# EAGLE design Summation line and synth (EAGLE 9.6.2)
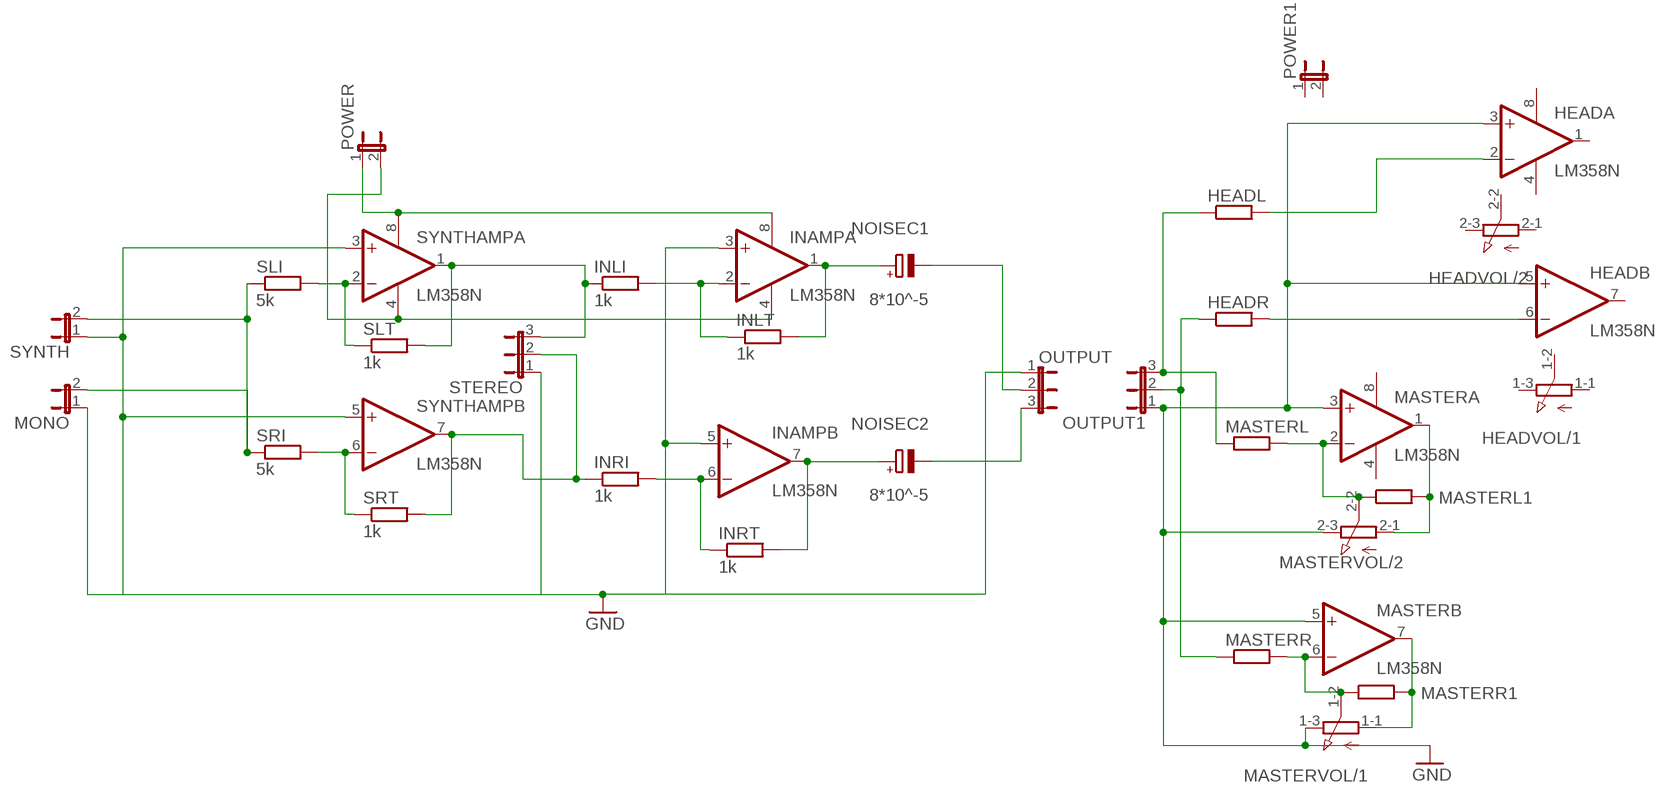
[diagram p0: schematic, sheet 1]

## Parts
HEAD  LM358N  [DIL08]
HEADL  R-EU_0207/7  [0207/7]
HEADR  R-EU_0207/7  [0207/7]
HEADVOL  3RP/1610G  [3RP/1610G]
INAMP  LM358N  [DIL08]
INLI  1k  R-EU_0207/7  [0207/7]
INLT  1k  R-EU_0207/7  [0207/7]
INRI  1k  R-EU_0207/7  [0207/7]
INRT  1k  R-EU_0207/7  [0207/7]
MASTER  LM358N  [DIL08]
MASTERL  R-EU_0207/7  [0207/7]
MASTERL1  R-EU_0207/7  [0207/7]
MASTERR  R-EU_0207/7  [0207/7]
MASTERR1  R-EU_0207/7  [0207/7]
MASTERVOL  3RP/1610G  [3RP/1610G]
MONO  JP1E  [JP1]
NOISEC1  8*10^-5  CPOL-EUE5-5  [E5-5]
NOISEC2  8*10^-5  CPOL-EUE5-5  [E5-5]
OUTPUT  JP2E  [JP2]
OUTPUT1  JP2E  [JP2]
POWER  JP1E  [JP1]
POWER1  JP1E  [JP1]
SLI  5k  R-EU_0207/7  [0207/7]
SLT  1k  R-EU_0207/7  [0207/7]
SRI  5k  R-EU_0207/7  [0207/7]
SRT  1k  R-EU_0207/7  [0207/7]
STEREO  JP2E  [JP2]
SYNTH  JP1E  [JP1]
SYNTHAMP  LM358N  [DIL08]

## Nets
GND: HEAD.3(A:+IN) HEAD.5(B:+IN) INAMP.3(A:+IN) INAMP.5(B:+IN) MASTER.3(A:+IN) MASTER.5(B:+IN) MASTERVOL.1-3(/1:E) MASTERVOL.2-3(/2:E) MONO.1 OUTPUT1.1 OUTPUT.1 STEREO.1 SYNTH.1 SYNTHAMP.3(A:+IN) SYNTHAMP.5(B:+IN)
N$1: INAMP.4(P:V-) POWER.2 SYNTHAMP.4(P:V-)
N$2: SLI.2 SLT.1 SYNTHAMP.2(A:-IN)
N$3: INAMP.6(B:-IN) INRI.2 INRT.1
N$4: SRI.2 SRT.1 SYNTHAMP.6(B:-IN)
N$5: INRI.1 SRT.2 STEREO.2 SYNTHAMP.7(B:OUT)
N$6: INAMP.2(A:-IN) INLI.2 INLT.1
N$7: INAMP.8(P:V+) POWER.1 SYNTHAMP.8(P:V+)
N$8: INLI.1 SLT.2 STEREO.3 SYNTHAMP.1(A:OUT)
N$9: INAMP.7(B:OUT) INRT.2 NOISEC2.+
N$10: INAMP.1(A:OUT) INLT.2 NOISEC1.+
N$11: NOISEC1.- OUTPUT.2
N$12: NOISEC2.- OUTPUT.3
N$13: MASTER.2(A:-IN) MASTERL1.1 MASTERL.2 MASTERVOL.2-2(/2:S)
N$14: HEADL.1 MASTERL.1 OUTPUT1.3
N$15: HEAD.2(A:-IN) HEADL.2
N$16: HEAD.6(B:-IN) HEADR.2
N$17: HEADR.1 MASTERR.1 OUTPUT1.2
N$18: MASTER.6(B:-IN) MASTERR1.1 MASTERR.2 MASTERVOL.1-2(/1:S)
N$21: MASTER.7(B:OUT) MASTERR1.2 MASTERVOL.1-1(/1:A)
N$22: MASTER.1(A:OUT) MASTERL1.2 MASTERVOL.2-1(/2:A)
SYNTHIN: MONO.2 SLI.1 SRI.1 SYNTH.2
Unconnected: HEAD.1(A:OUT) HEAD.7(B:OUT) HEADVOL.1-1(/1:A) HEADVOL.1-2(/1:S) HEADVOL.1-3(/1:E) HEADVOL.2-1(/2:A) HEADVOL.2-2(/2:S) HEADVOL.2-3(/2:E) POWER1.1 POWER1.2

## Power pins joined to a net without a drawn wire
V+: HEAD.8(P:V+) MASTER.8(P:V+)
V-: HEAD.4(P:V-) MASTER.4(P:V-)

## Library data of the parts
HEAD INAMP MASTER SYNTHAMP = linear:LM358: OP AMP also LM158; LM258; LM2904 Source: http://cache.national.com/ds/LM/LM158.pdf
HEADL HEADR INLI INLT INRI INRT MASTERL MASTERL1 MASTERR MASTERR1 SLI SLT SRI SRT = rcl:R-EU_: RESISTOR, European symbol; SPICEPREFIX: R
HEADVOL MASTERVOL = pot:3RP/1610G: 16mm Potentiometer two level Source: http://www.alphapotentiometers.net/html/16mm_pot_2.html
MONO POWER POWER1 SYNTH = jumper:JP1E: JUMPER
NOISEC1 NOISEC2 = rcl:CPOL-EU: POLARIZED CAPACITOR, European symbol; SPICEPREFIX: C
OUTPUT OUTPUT1 STEREO = jumper:JP2E: JUMPER

## Board
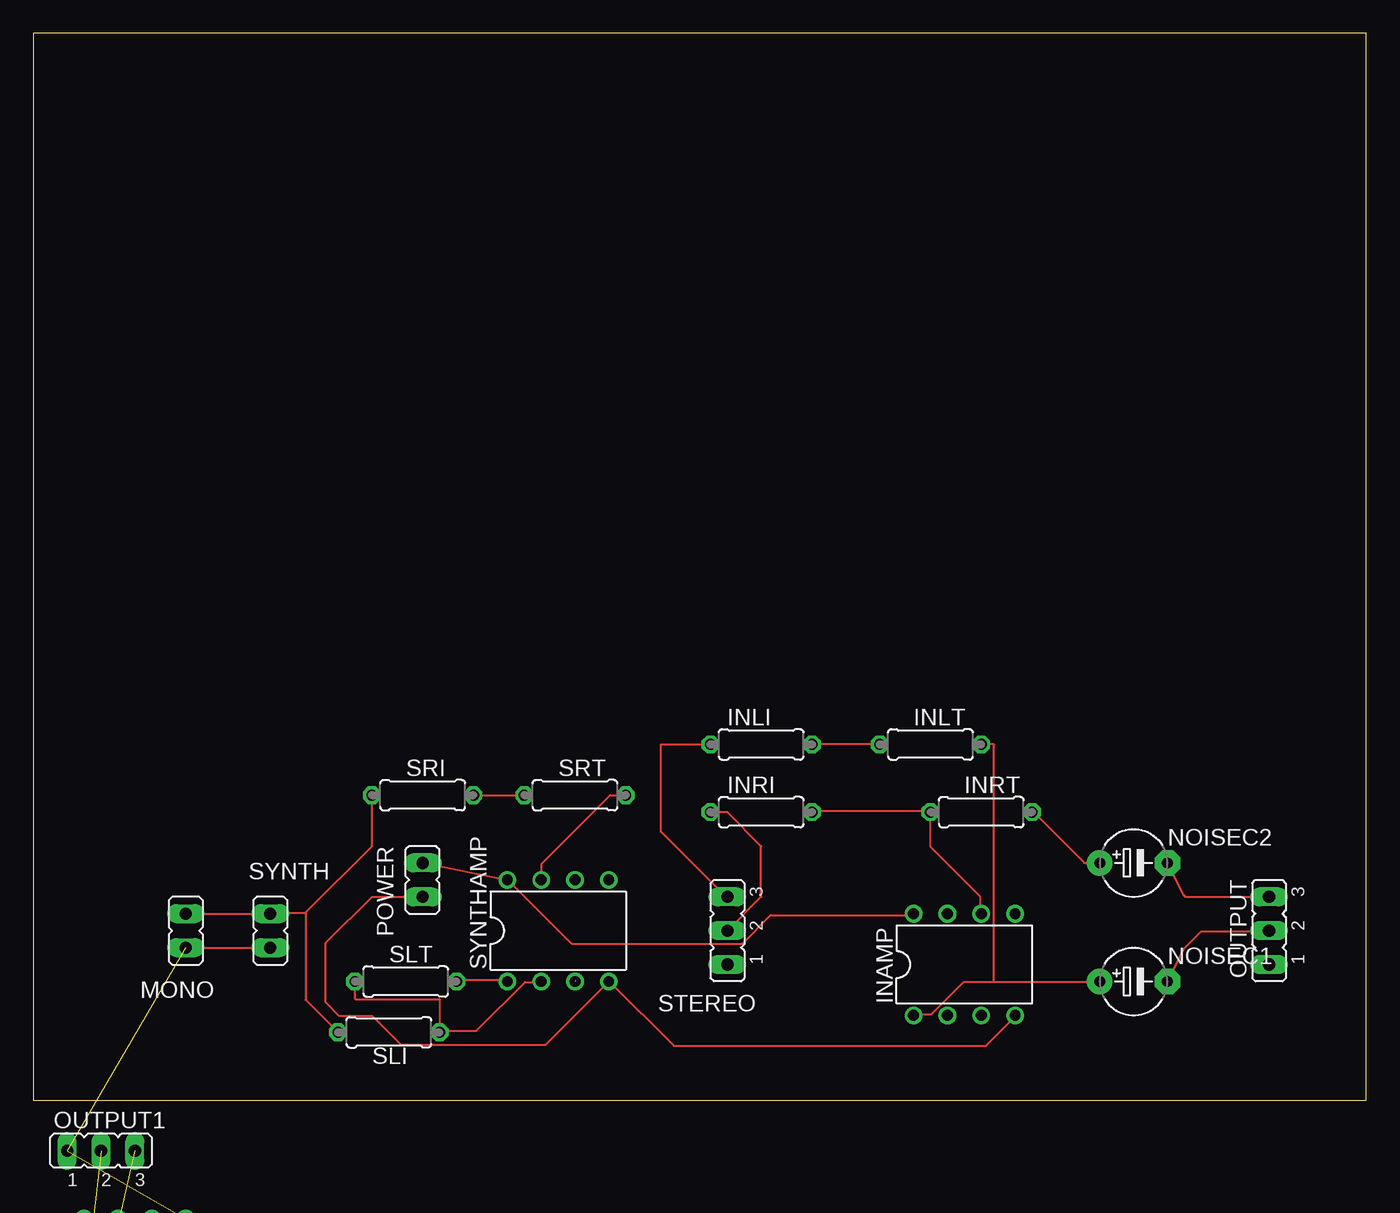
[diagram p1: board, top side]
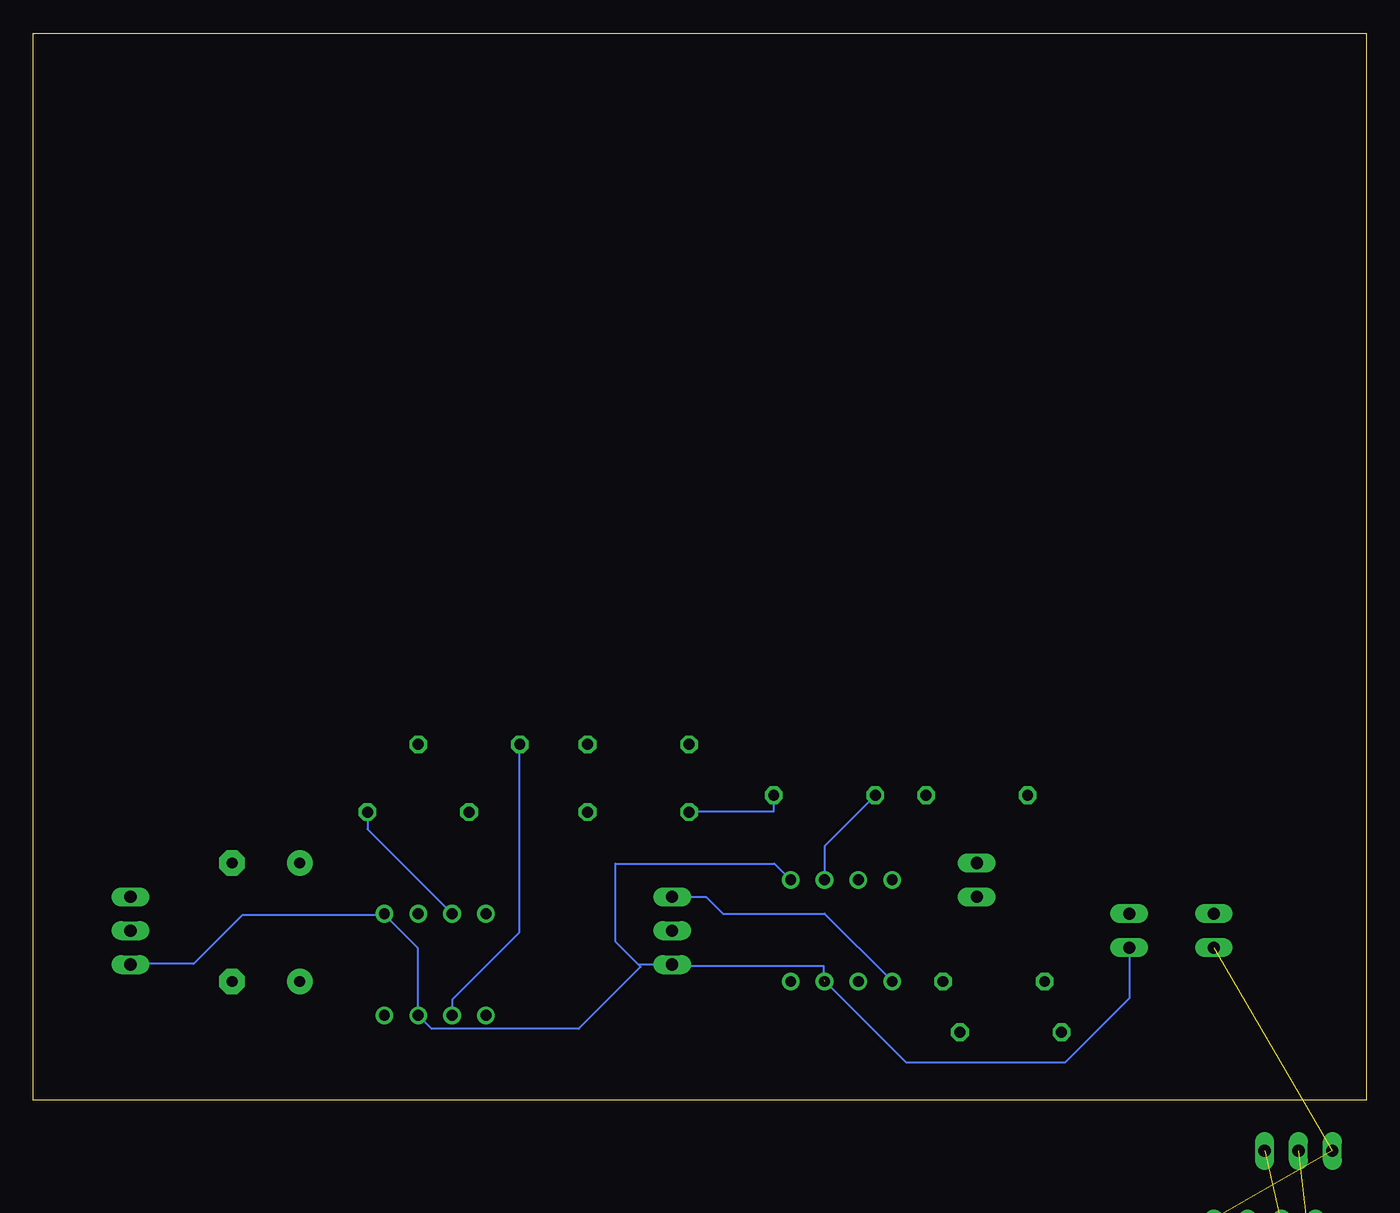
[diagram p2: board, bottom side, seen from below]

Size 100 x 80 mm. Coordinates in mm from the lower left corner, seen from the top.
Outline: 0,0 100,0 100,80 0,80 0,0
Copper layers (1*16): Top 0.035mm / dielectric 1.5mm / Bottom 0.035mm
Design rules "default": minimum track width 6mil, minimum drill 0.35mm, track to track 6mil, track to pad 6mil, pad to pad 6mil, via to via 6mil, smd to smd 6mil, copper to edge 40mil, drill to drill 6mil, minimum pad ring 10mil, minimum via ring 8mil, stop-mask expansion 4mil, vias tented up to drill 0mil, thermal gap 10mil

### Footprints (pad centres in the part's own frame; a part is rotated, then mirrored left to right if it is on the bottom)
DIL08 = drill 0.813 pad 1.27: 1 -3.81,-3.81; 2 -1.27,-3.81; 3 1.27,-3.81; 4 3.81,-3.81; 5 3.81,3.81; 6 1.27,3.81; 7 -1.27,3.81; 8 -3.81,3.81
0207/7 = drill 0.813 octagon: 1 -3.81,0; 2 3.81,0
3RP/1610G = drill 1.2 pad 2.184: 1-1 -5,0; 1-2 0,0; 1-3 5,0; 2-1 -5,5; 2-2 0,5; 2-3 5,5
JP1 = drill 0.914 long: 1 0,-1.27; 2 0,1.27
E5-5 = drill 0.813 pad 1.905: + -2.54,0 | drill 0.813 pad 1.905 octagon: - 2.54,0
JP2 = drill 0.914 long: 1 -2.54,0; 2 0,0; 3 2.54,0

### Placement (x,y rotation side)
HEAD  7.62,-12.7 0 top  (outside the outline)
HEADL  5.08,-31.75 0 top  (outside the outline)
HEADR  5.08,-36.83 0 top  (outside the outline)
HEADVOL  -8.89,-43.18 0 top  (outside the outline)
INAMP  69.85,10.16 0 top
INLI  54.61,26.67 0 top
INLT  67.31,26.67 0 top
INRI  54.61,21.59 0 top
INRT  71.12,21.59 0 top
MASTER  7.62,-22.86 0 top  (outside the outline)
MASTERL  5.08,-41.91 0 top  (outside the outline)
MASTERL1  -30.48,-60.96 0 top  (outside the outline)
MASTERR  5.08,-46.99 0 top  (outside the outline)
MASTERR1  -30.48,-66.04 0 top  (outside the outline)
MASTERVOL  -26.67,-43.18 0 top  (outside the outline)
MONO  11.43,12.7 0 top
NOISEC1  82.55,8.89 0 top
NOISEC2  82.55,17.78 0 top
OUTPUT  92.71,12.7 90 top
OUTPUT1  5.08,-3.81 0 top  (outside the outline)
POWER  29.21,16.51 180 top
POWER1  3.81,-54.61 0 top  (outside the outline)
SLI  26.67,5.08 0 top
SLT  27.94,8.89 0 top
SRI  29.21,22.86 0 top
SRT  40.64,22.86 0 top
STEREO  52.07,12.7 90 top
SYNTH  17.78,12.7 0 top
SYNTHAMP  39.37,12.7 0 top

### Tracks (layer width: path | path; a pad name or v marks a point on that pad's centre or on a via)
GND  (via drill 0.35)  (8 unrouted)
  Top 0.152: v51.97,10.06 STEREO.1 | MONO.1 SYNTH.1
  Bottom 0.152: OUTPUT.1 92.66,10.21 87.99,10.21 84.33,13.87 73.76,13.87 INAMP.5 73.61,13.87 71.17,11.43 71.17,6.4 INAMP.3 70.1,5.33 59.08,5.33 54.43,9.98 54.61,10.16 | v40.69,8.99 40.69,10.06 v51.97,10.06 | SYNTHAMP.5 44.4,17.73 56.34,17.73 56.34,11.89 54.61,10.16 | STEREO.1 54.61,10.16 | SYNTH.1 17.78,7.62 22.55,2.85 34.54,2.85 40.54,8.84 SYNTHAMP.3
N$1
  Top 0.152: INAMP.4 73.66,6.25 71.48,4.06 48.06,4.06 43.28,8.84 SYNTHAMP.4 38.41,4.12 27.64,4.12 25.45,6.3 22.96,6.3 21.95,7.32 21.95,11.79 25.4,15.24 POWER.2
N$2
  Top 0.152: SLT.1 24.13,7.57 30.48,7.57 30.48,5.18 | 30.48,5.18 33.22,5.18 36.88,8.84 38.1,8.84 SYNTHAMP.2 | 30.48,5.18 SLI.2
N$3
  Top 0.152: INAMP.6 71.02,14.02 71.02,15.29 67.31,19 INRT.1 67.21,21.64 58.52,21.64 INRI.2
N$4
  Top 0.152: 36.73,22.91 SRT.1 SRI.2
  Bottom 0.152: SYNTHAMP.6 40.64,19.05 SRT.1
N$5
  Top 0.152: SYNTHAMP.7 38.1,17.68 43.28,22.86 SRT.2 | 52.07,21.59 | 52.07,21.59 INRI.1 | 52.12,12.8 STEREO.2 54.61,15.24 54.61,19.05 52.07,21.59
  Bottom 0.152: 44.5,22.91 SRT.2 44.45,21.64 50.75,21.64 INRI.1
N$6
  Top 0.152: INLT.1 INLI.2
  Bottom 0.152: INAMP.2 68.58,7.52 63.55,12.55 63.55,26.67 INLT.1
N$7
  Top 0.152: POWER.1 SYNTHAMP.8 35.66,16.46 40.39,11.73 53.19,11.73 55.32,13.87 65.99,13.87 INAMP.8
N$8
  Top 0.152: SLT.2 31.75,8.99 35.51,8.99 SYNTHAMP.1 | INLI.1 47.09,26.67 47.09,20.12 51.97,15.24 STEREO.3
  Bottom 0.152: SYNTHAMP.1 40.64,13.97 48.26,13.97 49.53,15.24 STEREO.3
N$9
  Top 0.152: 79.96,17.78 NOISEC2.+ 78.84,17.78 74.98,21.64 INRT.2 74.98,21.49
  Bottom 0.152: INRT.2 74.93,20.32 INAMP.7
N$10
  Top 0.152: NOISEC1.+ 80.01,8.84 72.08,8.84 | 72.08,8.84 69.8,8.84 67.36,6.4 66.14,6.4 INAMP.1 | 72.08,8.84 72.08,26.67 INLT.2
N$11
  Top 0.152: OUTPUT.2 92.66,12.65 87.63,12.65 86.31,11.33 NOISEC1.-
N$12
  Top 0.152: OUTPUT.3 86.41,15.24 86.31,15.34 NOISEC2.-
N$13  (3 unrouted)
N$14  (2 unrouted)
N$15  (1 unrouted)
N$16  (1 unrouted)
N$17  (2 unrouted)
N$18  (3 unrouted)
N$21  (2 unrouted)
N$22  (2 unrouted)
SYNTHIN
  Top 0.152: 25.35,22.76 SRI.1 25.4,19.05 20.42,14.07 20.42,14.02 | SLI.1 20.42,7.52 20.42,14.02 | 20.42,14.02 17.88,14.02 SYNTH.2 MONO.2
V+  (1 unrouted)
V-  (1 unrouted)